# EAGLE design battery_pack (EAGLE 6.6.0)
AUTHOR: Joshua Adkins; REV: A; TITLE: Battery_Pack
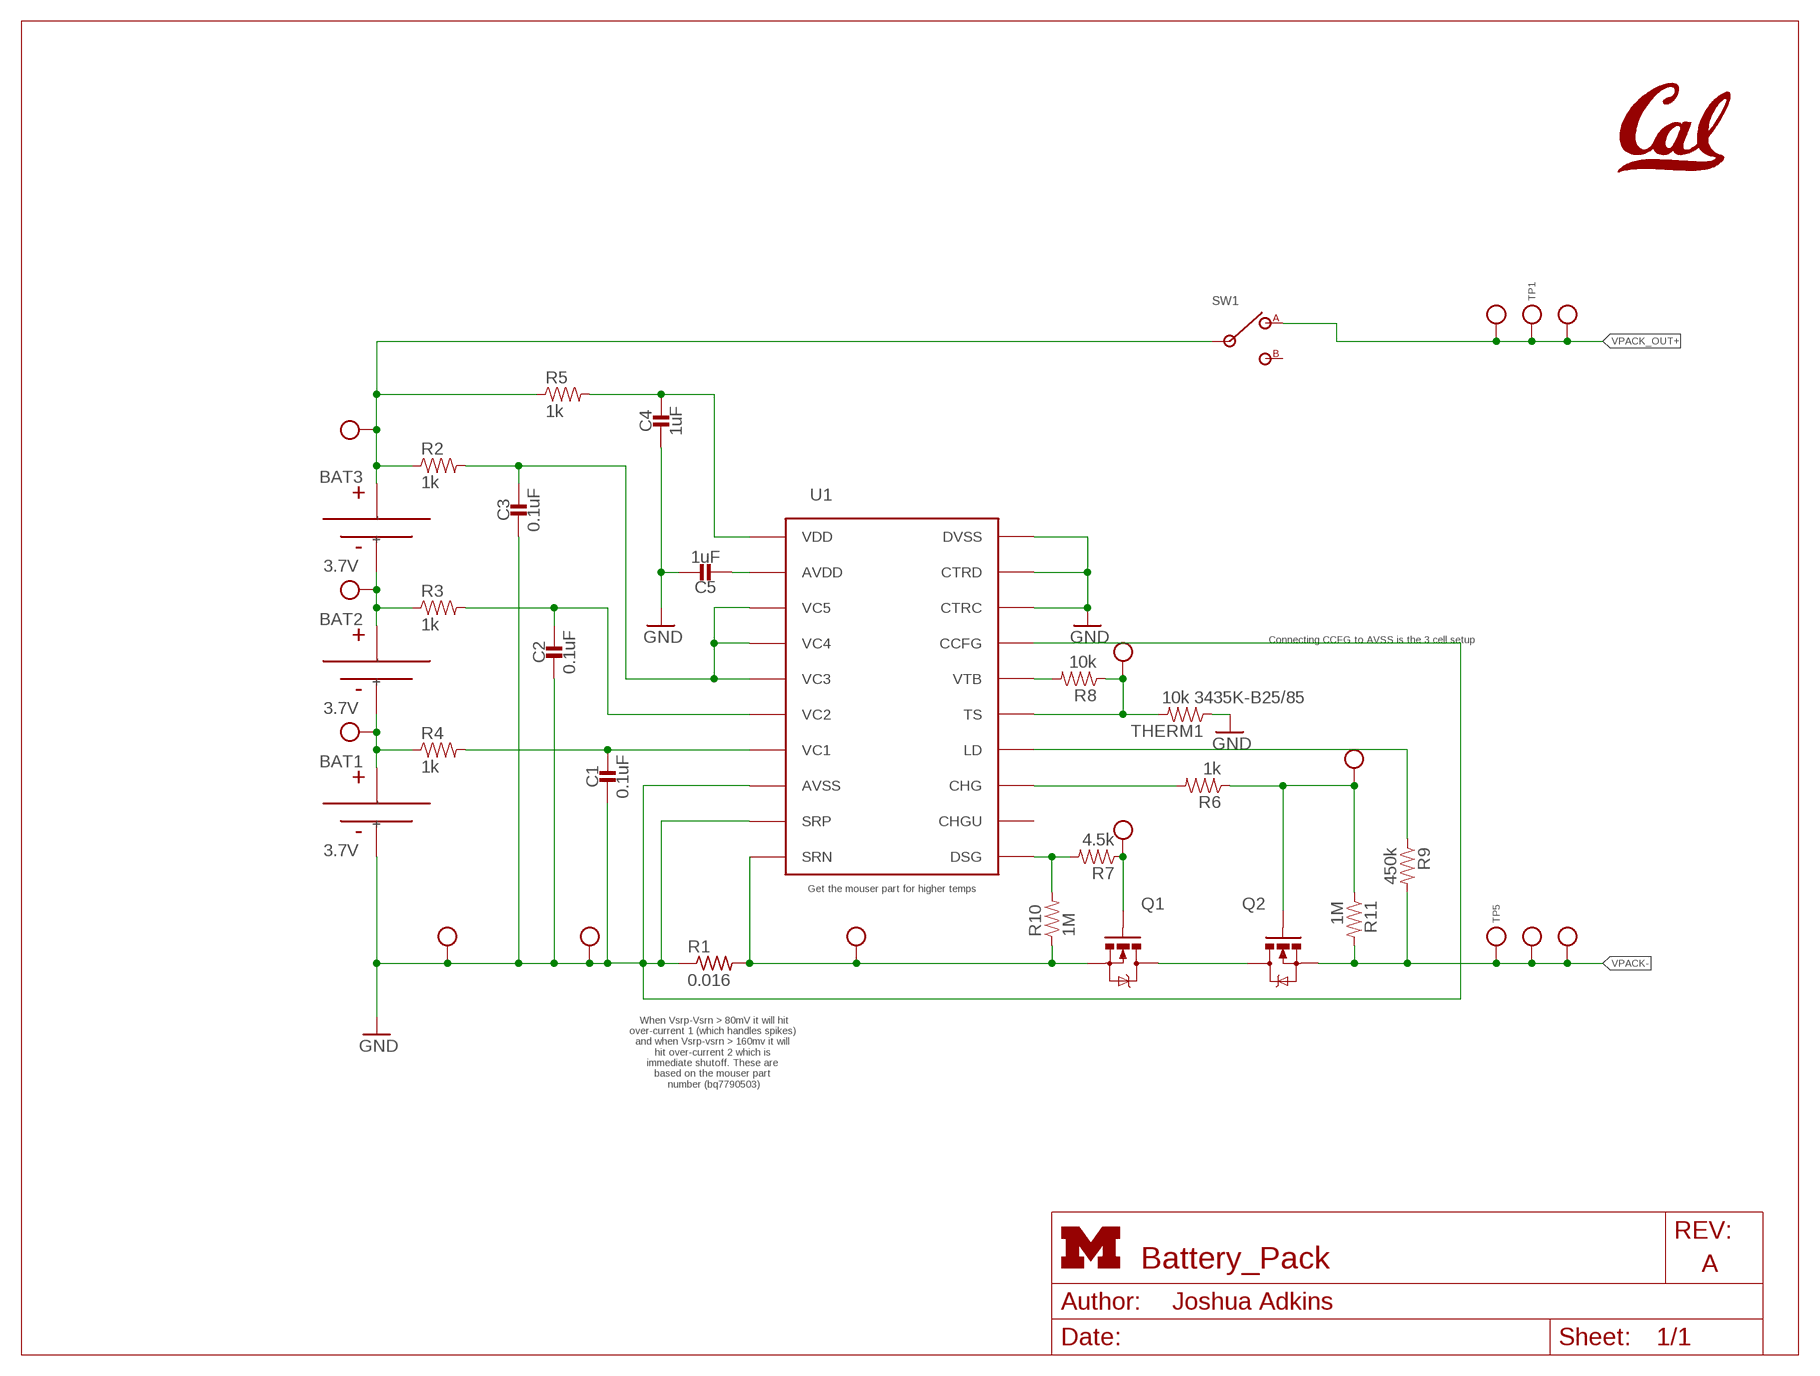
[diagram p0: schematic, sheet 1]
FRAME1 (LETTER_L_UMICH): HEIGHT: 8.5in; WIDTH: 11in

## Parts
BAT1  3.7V  BAT-CELL  [PL-809797-1C]
BAT2  3.7V  BAT-CELL  [PL-809797-1C]
BAT3  3.7V  BAT-CELL  [PL-809797-1C]
C1  0.1uF  CAPACITOR0603_CAP  [0603_CAP]
C2  0.1uF  CAPACITOR0603_CAP  [0603_CAP]
C3  0.1uF  CAPACITOR0603_CAP  [0603_CAP]
C4  1uF  CAPACITOR0603_CAP  [0603_CAP]
C5  1uF  CAPACITOR0603_CAP  [0603_CAP]
Q1  MOSFET-NCHANNELFDD8580  [DPAK]
Q2  MOSFET-NCHANNELFDD8580  [DPAK]
R1  0.016  R-US_R1206  [R1206]
R2  1k  RESISTOR0603_RES  [0603-RES]
R3  1k  RESISTOR0603_RES  [0603-RES]
R4  1k  RESISTOR0603_RES  [0603-RES]
R5  1k  RESISTOR0603_RES  [0603-RES]
R6  1k  RESISTOR0603_RES  [0603-RES]
R7  4.5k  RESISTOR0603_RES  [0603-RES]
R8  10k  RESISTOR0603_RES  [0603-RES]
R9  450k  RESISTOR0603_RES  [0603-RES]
R10  1M  RESISTOR0603_RES  [0603-RES]
R11  1M  RESISTOR0603_RES  [0603-RES]
SW1  500ASSP  [500ASSP]
THERM1  10k 3435K-B25/85  RESISTOR0603_RES  [0603-RES]
TP1  TEST_POINT_0.060IN  [TESTPOINT_0.060IN]
TP2  TEST_POINT_0.112IN  [TESTPOINT_0.112IN]
TP3  TEST_POINT_0.040IN  [TESTPOINT_0.040IN]
TP4  TEST_POINT_0.040IN  [TESTPOINT_0.040IN]
TP5  TEST_POINT_0.060IN  [TESTPOINT_0.060IN]
TP6  TEST_POINT_0.112IN  [TESTPOINT_0.112IN]
TP7  TEST_POINT_0.112IN  [TESTPOINT_0.112IN]
TP8  TEST_POINT_0.112IN  [TESTPOINT_0.112IN]
TP9  TEST_POINT_0.040IN  [TESTPOINT_0.040IN]
TP10  TEST_POINT_0.040IN  [TESTPOINT_0.040IN]
TP11  TEST_POINT_0.040IN  [TESTPOINT_0.040IN]
TP12  TEST_POINT_0.040IN  [TESTPOINT_0.040IN]
TP13  TEST_POINT_0.040IN  [TESTPOINT_0.040IN]
TP14  TEST_POINT_0.112IN  [TESTPOINT_0.112IN]
TP15  TEST_POINT_0.112IN  [TESTPOINT_0.112IN]
U1  BQ77904  [TSSOP-20/6MM]
U$1  UCB_CAL500MIL  [UCB_CAL_500MIL]

## Nets
GND: BAT1.- C1.2 C2.2 C3.2 C4.2 C5.1 R1.1 THERM1.1 TP7.1(TESTPOINT) TP9.TESTPOINT U1.8(AVSS) U1.9(SRP) U1.17(CCFG) U1.18(CTRC) U1.19(CTRD) U1.20(DVSS)
N$1: BAT1.+ BAT2.- R4.1 TP15.1(TESTPOINT)
N$2: BAT2.+ BAT3.- R3.1 TP14.1(TESTPOINT)
N$4: C1.1 R4.2 U1.7(VC1)
N$5: C2.1 R3.2 U1.6(VC2)
N$6: C3.1 R2.2 U1.3(VC5) U1.4(VC4) U1.5(VC3)
N$7: Q1.4(D) Q2.4(D)
N$8: Q1.3(S) R1.2 R10.1 TP10.TESTPOINT U1.10(SRN)
N$9: C4.1 R5.2 U1.1(VDD)
N$10: R7.2 R10.2 U1.11(DSG)
N$11: C5.2 U1.2(AVDD)
N$12: Q1.1(G) R7.1 TP11.TESTPOINT
N$13: R6.2 U1.13(CHG)
N$14: Q2.1(G) R6.1 R11.1 TP12.TESTPOINT
N$17: R9.1 U1.14(LD)
N$18: R8.2 U1.16(VTB)
N$19: R8.1 THERM1.2 TP13.TESTPOINT U1.15(TS)
VPACK+: BAT3.+ R2.1 R5.1 SW1.2 TP8.1(TESTPOINT)
VPACK-: Q2.3(S) R9.2 R11.2 TP2.1(TESTPOINT) TP4.TESTPOINT TP5.TESTPOINT
VPACK_OUT+: SW1.1 TP1.TESTPOINT TP3.TESTPOINT TP6.1(TESTPOINT)
Unconnected: SW1.3 U1.12(CHGU)

## Notes on the sheet
- Connecting CCFG to AVSS is the 3 cell setup
- Get the mouser part for higher temps
- When Vsrp-Vsrn > 80mV it will hit
  over-current 1 (which handles spikes) 
  and when Vsrp-vsrn > 160mv it will 
  hit over-current 2 which is 
  immediate shutoff. These are 
  based on the mouser part 
  number (bq7790503)

## Library data of the parts
BAT1-BAT3 = batteries:BAT-CELL: A single cell of a battery
C1-C3 = passives:CAPACITOR: SMD Capacitor; DESCRIPTION: CAP CER 0.1UF 25V Y5V 0603; DIGIKEY: 311-1087-1-ND; MANUFACTURER: Yageo; MPN: CC0603ZRY5V8BB104
C4 C5 = passives:CAPACITOR: SMD Capacitor; DESCRIPTION: CAP CER 1UF 25V X5R 0603; DIGIKEY: 311-1445-1-ND; MANUFACTURER: Yageo; MPN: CC0603KRX5R8BB105
Q1 Q2 = fets:MOSFET-NCHANNEL: Generic NMOS footprint; DESCRIPTION: MOSFET N-CH 40V 50A DPAK; DIGIKEY: FDD8447L_F085CT-ND; MANUFACTURER: Fairchild Semiconductor; MPN: FDD8447L_F085
R1 = resistor:R-US_: RESISTOR, American symbol; DESCRIPTION: RES SMD 16 MOHM 1% 1W 1206; DIGIKEY: P0.016BVCT-ND; MANUFACTURER: Panasonic; MPN: ERJ8CWFR016V
R2-R6 = passives:RESISTOR: Resistor Basic schematic elements and footprints for 0603, 1206, and PTH resistors.; DESCRIPTION: RES SMD 1K OHM 5% 1/10W 0603; DIGIKEY: 311-1.0KGRCT-ND; MANUFACTURER: Yageo; MPN: RC0603JR-071KL
R7 = passives:RESISTOR: Resistor Basic schematic elements and footprints for 0603, 1206, and PTH resistors.; DESCRIPTION: RES SMD 4.53K OHM 1% 1/10W 0603; DIGIKEY: 311-4.53KHRCT-ND; MANUFACTURER: Yageo; MPN: RC0603FR-074K53L
R8 = passives:RESISTOR: Resistor Basic schematic elements and footprints for 0603, 1206, and PTH resistors.; DESCRIPTION: RES SMD 10K OHM 5% 1/10W 0603; DIGIKEY: 311-10KGRCT-ND; MANUFACTURER: Yageo; MPN: RC0603JR-0710KL
R9 = passives:RESISTOR: Resistor Basic schematic elements and footprints for 0603, 1206, and PTH resistors.; DESCRIPTION: RES SMD 453K OHM 1% 1/10W 0603; DIGIKEY: 311-453KHRCT-ND; MANUFACTURER: Yageo; MPN: RC0603FR-07453KL
R10 R11 = passives:RESISTOR: Resistor Basic schematic elements and footprints for 0603, 1206, and PTH resistors.; DESCRIPTION: RES SMD 1M OHM 5% 1/10W 0603; DIGIKEY: 311-1.0MGRCT-ND; MANUFACTURER: Yageo; MPN: RC0603JR-071ML
SW1 = switches:500ASSP: High current slide switch; DIGIKEY: EG2483-ND; MANUFACTURER: EWSITCH; MPN: 500ASSP1M6QE
THERM1 = passives:RESISTOR: Resistor Basic schematic elements and footprints for 0603, 1206, and PTH resistors.; DESCRIPTION: NTC THERMISTOR 10K OHM 1% 0603; DIGIKEY: 445-2554-1-ND; MANUFACTURER: TDK; MPN: NTCG163JF103FT1
TP1 TP5 = headers:TEST_POINT_0.060IN: A 60mil Testpoint
TP2 TP6-TP8 TP14 TP15 = headers:TEST_POINT_0.112IN: Solder terminal, turreted; NEWARK: 40F6015
TP3 TP4 TP9-TP13 = headers:TEST_POINT_0.040IN: 0.040in Test Point; DIGIKEY: 5001K-ND
U1 = chips:BQ77904: A battery protection chip with OV/UV/OT/UT; DIGIKEY: 296-44599-5-ND; MANUFACTURER: TI; MOUSER: 595-BQ7790503PW; MPN: BQ7790503PW
U$1 = logos:UCB_CAL

## Board
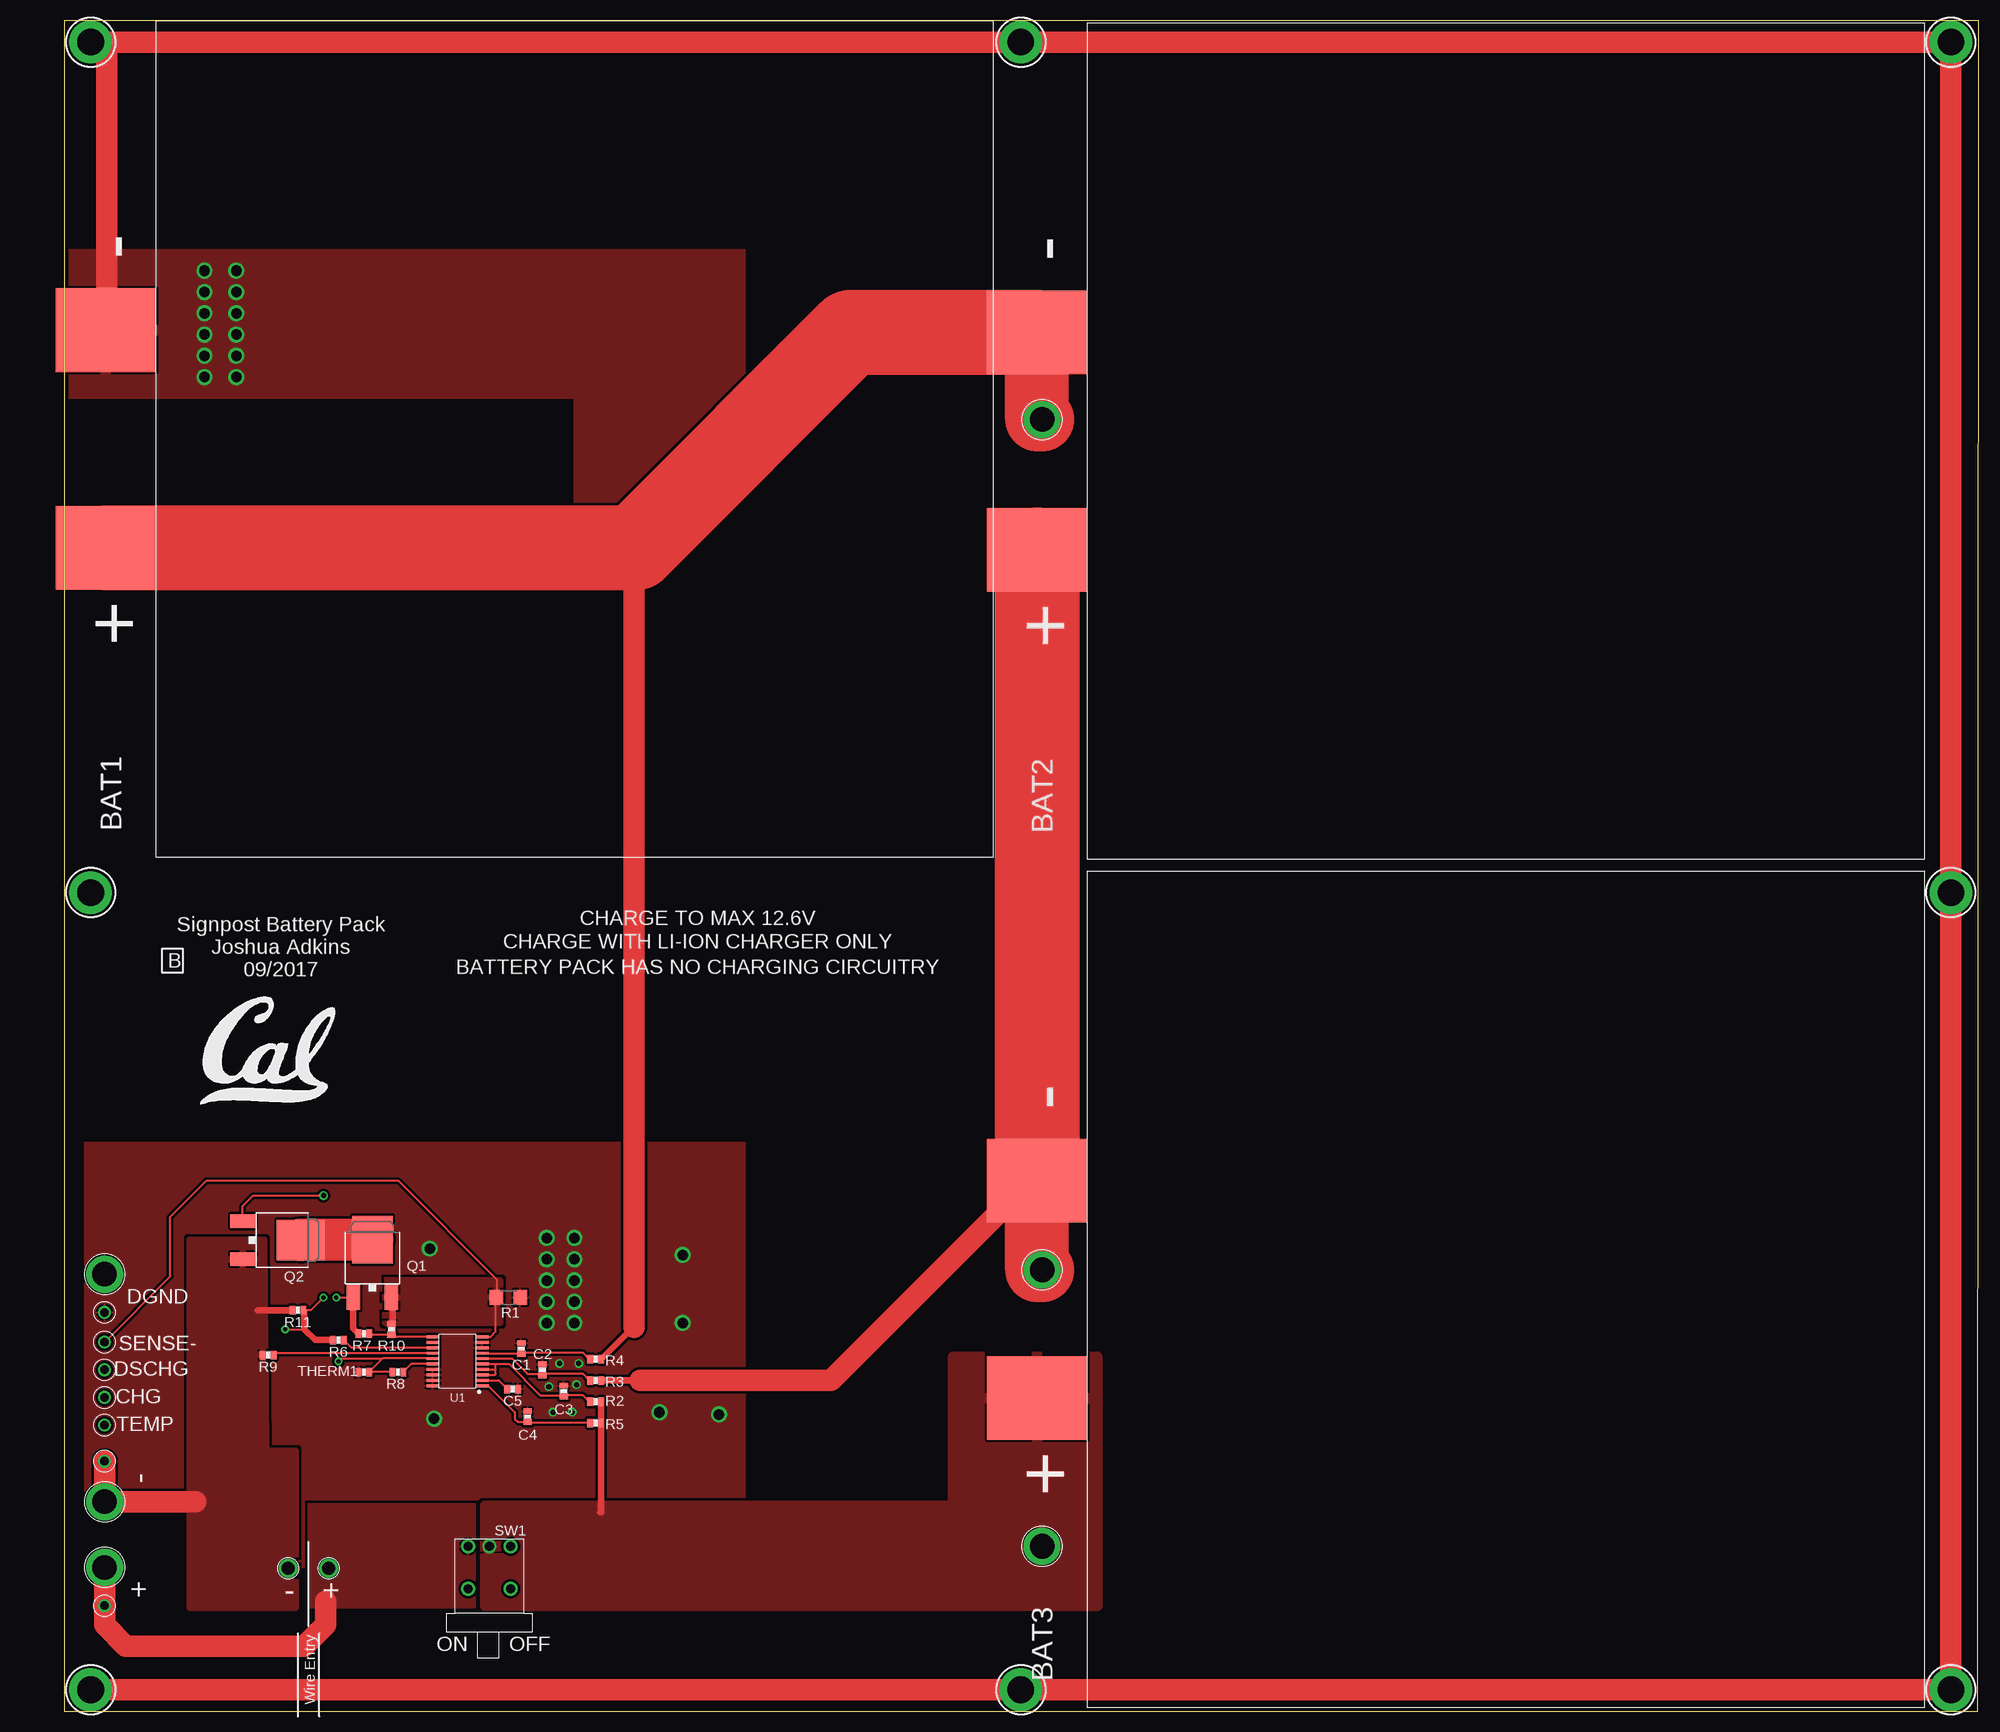
[diagram p1: board, top side]
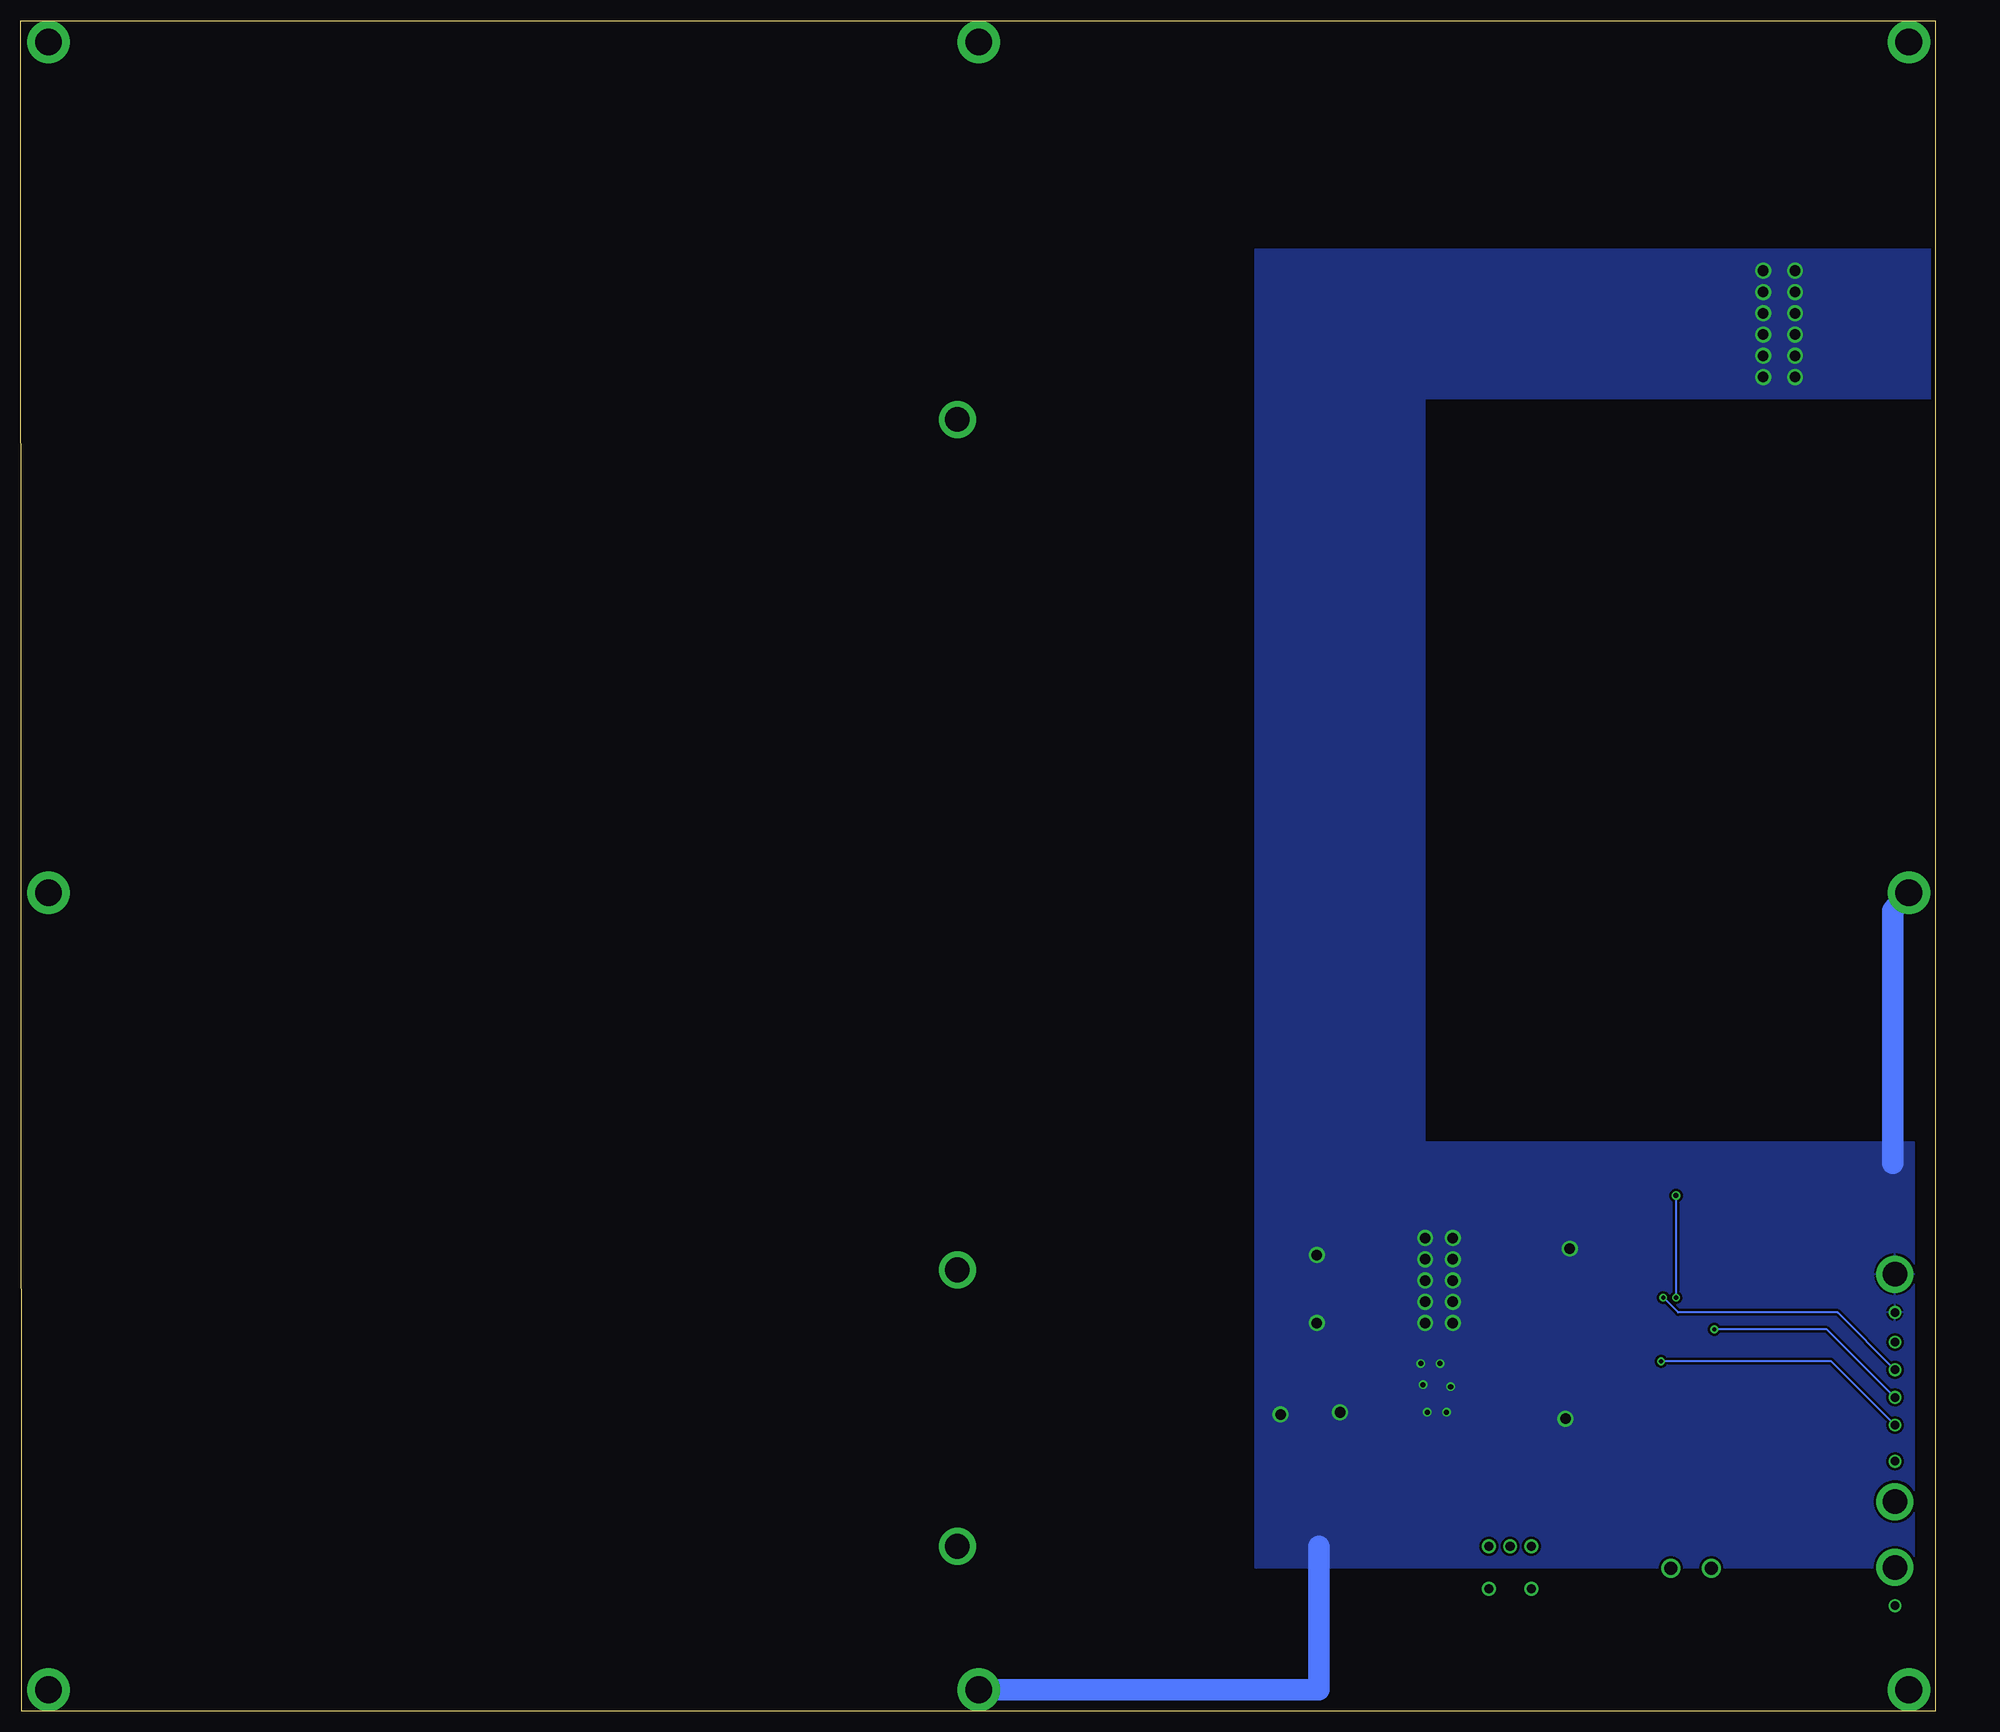
[diagram p2: board, bottom side, seen from below]

Size 228.73 x 201.93 mm. Coordinates in mm from the lower left corner, seen from the top.
Outline: 0,0 228.6,0 228.73,201.93 0.02,201.93 0,0
Copper layers (1*16): Top 0.0178mm / dielectric 59mil / Bottom 0.0178mm
Design rules "quickturn_co_kr_1oz": minimum track width 4mil, minimum drill 0.200659375mm, track to track 4mil, track to pad 4mil, pad to pad 4mil, via to via 4mil, smd to smd 4mil, copper to edge 20mil, drill to drill 16mil, minimum pad ring 8mil, minimum via ring 8mil, stop-mask expansion 3mil, vias tented up to drill 50mil, thermal gap 10mil

### Footprints (pad centres in the part's own frame; a part is rotated, then mirrored left to right if it is on the bottom)
PL-809797-1C = smd 10 x 12: + 37,106; - 63,106
0603_CAP = smd 0.7 x 1: 1 -0.65,0; 2 0.65,0
DPAK = smd 1.6 x 3: 1 -2.28,-5.31; 3 2.28,-5.31 | smd 4.826 x 5.715: 4 0,1.588
R1206 = smd 1.6 x 1.803: 1 -1.422,0; 2 1.422,0
0603-RES = smd 0.7 x 1: 1 -0.65,0; 2 0.65,0
500ASSP = drill 1.09: 1 2.54,0; 2 0,0; 3 -2.54,0; P$4 2.54,5.08; P$5 -2.54,5.08
TESTPOINT_0.060IN = drill 1.524: TESTPOINT -0.02,0.033
TESTPOINT_0.112IN = drill 2.946: 1 0,0
TESTPOINT_0.040IN = drill 1.016: TESTPOINT 0,0
TSSOP-20/6MM = smd 1.5 x 0.35: 1 -2.95,2.925; 2 -2.95,2.275; 3 -2.95,1.625; 4 -2.95,0.975; 5 -2.95,0.325; 6 -2.95,-0.325; 7 -2.95,-0.975; 8 -2.95,-1.625; 9 -2.95,-2.275; 10 -2.95,-2.925; 11 2.95,-2.925; 12 2.95,-2.275; 13 2.95,-1.625; 14 2.95,-0.975; 15 2.95,-0.325; 16 2.95,0.325; 17 2.95,0.975; 18 2.95,1.625; 19 2.95,2.275; 20 2.95,2.925

### Placement (x,y rotation side)
BAT1  111,101.98 90 top
BAT2  222.25,101.73 90 top
BAT3  222.25,0.38 90 top
C1  54.61,43.31 90 top
C2  57.15,40.77 90 top
C3  59.69,38.23 90 top
C4  55.37,35.18 90 top
C5  53.59,38.48 180 top
Q1  36.83,54.74 0 top
Q2  26.67,56.26 270 top
R1  53.09,49.4 180 top
R2  63.5,36.96 180 top
R3  63.5,39.5 180 top
R4  63.5,42.04 180 top
R5  63.5,34.42 180 top
R6  32.77,44.32 0 top
R7  35.81,45.09 0 top
R8  39.88,40.51 0 top
R9  24.38,42.55 180 top
R10  39.12,45.59 270 top
R11  27.94,47.88 180 top
SW1  50.8,19.68 180 top
THERM1  35.81,40.51 0 top
TP1  31.62,17.02 0 top
TP2  4.83,25.02 180 top
TP3  4.83,12.57 180 top
TP4  4.83,29.84 180 top
TP5  26.8,17.02 0 top
TP6  4.83,17.14 180 top
TP7  4.83,52.2 180 top
TP8  116.84,19.68 180 top
TP9  4.83,47.62 180 top
TP10  4.83,44.07 270 top
TP11  4.83,40.77 270 top
TP12  4.83,37.47 270 top
TP13  4.83,34.16 270 top
TP14  116.84,52.7 180 top
TP15  116.84,154.31 180 top
U1  46.99,41.78 180 top
U$1  16.26,72.52 0 top

### Tracks (layer width: path | path; a pad name or v marks a point on that pad's centre or on a via)
GND  (via drill 0.61, 1.27, 3.17 pad 5.08)
  Top 2.54: v3.17,2.54 v114.3,2.54 v225.43,2.54 v225.43,97.79 v225.43,199.39 v114.3,199.39 v3.17,199.39 5.08,199.39 5.08,164.47
  Bottom 2.54: v114.3,2.54 73.66,2.54 73.66,19.68 | v3.17,97.79 5.08,95.63 5.08,65.41
  other vias: 16.76,159.38 16.76,161.93 16.76,164.47 16.76,167 16.76,169.54 16.76,172.09 20.57,159.38 20.57,161.93 20.57,164.47 20.57,167 20.57,169.54 20.57,172.09 43.69,55.24 44.2,34.92 57.66,46.35 57.66,48.9 57.66,51.44 57.66,53.98 57.66,56.52 57.91,38.73 58.42,35.69 59.18,41.53 60.71,35.69 60.96,46.35 60.96,48.9 60.96,51.44 60.96,53.98 60.96,56.52 61.21,38.99 61.47,41.53 71.12,35.69 73.91,46.35 73.91,54.48 78.23,35.43
  pour Bottom (isolate 0.305): 81.28,17.14 2.54,17.14 2.54,67.94 81.28,67.94
  pour Bottom (isolate 0.305): 0,174.62 81.28,174.62 81.28,57.78 60.96,57.78 60.96,156.84 0,156.84
  pour Top (isolate 0.305, rank 2): 81.28,17.14 2.54,17.14 2.54,67.94 81.28,67.94
  pour Top (isolate 0.305): 0,174.62 81.28,174.62 81.28,57.78 60.96,57.78 60.96,156.84 0,156.84
  pour Top (isolate 0.305): 12.19,158.62 12.19,172.59 0.25,172.59 0.25,158.62
N$1
  Top 0.254: 68.07,45.85 67.96,45.85
  Top 0.762: 67.96,45.85 R4.1
  Top 10.16: BAT2.- 116.24,164.72 93.98,164.72 68.71,139.45 68.24,138.98 BAT1.+
  Top 2.54: 68.07,45.85 68.07,138.81 68.71,139.45
  Top 7.62: BAT2.- 116.25,154.31 TP15.1
N$2
  Top 0.762: R3.1 68.83,39.5
  Top 10.16: BAT2.+ 116.25,65.41 116.25,64.14 BAT3.-
  Top 2.54: 68.83,39.5 91.61,39.5 116.25,64.14
  Top 7.62: 116.25,65.41 116.25,52.7 TP14.1
N$4
  Top 0.254: U1.7 54.51,42.76 C1.1 54.75,42.8 61.98,42.8 62.74,42.04 R4.2
N$5
  Top 0.254: U1.6 53.52,42.11 55.37,40.26 57.01,40.26 C2.1 57.29,40.26 61.98,40.26 62.74,39.5 R3.2
N$6
  Top 0.254: U1.3 51.46,40.16 51.56,40.26 51.56,40.77 | U1.4 51.52,40.81 51.56,40.77 | U1.5 51.56,41.46 | 51.56,40.77 51.56,41.46 | 51.56,41.46 53.16,41.46 56.9,37.72 59.55,37.72 C3.1 59.83,37.72 61.98,37.72 62.74,36.96 R2.2
N$7
  Top 5.08: Q1.4 Q2.4
N$8
  Top 0.254: TP10.TESTPOINT 12.7,51.94 12.7,59.05 17.02,63.37 39.88,63.37 51.66,51.59 R1.2 51.56,49.3 51.56,45.34 50.93,44.71 U1.10
  Top 0.762: R10.1 39.24,46.36 39.24,49.3
  Top 1.27: 39.24,49.3 Q1.3
  pour Top (isolate 0.305): 52.07,51.44 38.35,51.44 38.35,46.35 52.07,46.35
N$9
  Top 0.254: U1.1 50.68,38.86 53.85,35.69 53.85,34.92 54.24,34.53 C4.1 55.48,34.42 R5.2
N$10
  Top 0.254: R7.2 36.61,44.94 R10.2 39.35,44.71 U1.11
N$11
  Top 0.254: U1.2 51.92,39.51 C5.2
N$12  (via drill 0.51)
  Top 0.254: v32.51,49.4 34.53,49.4 Q1.1
  Top 0.762: R7.1 34.55,45.7 Q1.1
  Bottom 0.254: v32.51,49.4 30.73,47.62 11.68,47.62 TP11.TESTPOINT
N$13
  Top 0.254: R6.2 34.33,43.41 U1.13
N$14  (via drill 0.51, 0.61)
  Top 0.254: Q2.1 21.36,60.35 22.61,61.59 v30.99,61.59 | v26.42,45.59 28.7,45.59 | 28.7,47.77 R11.1 29.46,47.88 v30.99,49.4
  Top 0.762: 28.7,47.77 28.7,45.59 29.97,44.32 R6.1
  Bottom 0.254: v26.42,45.59 12.95,45.59 TP12.TESTPOINT | v30.99,61.59 v30.99,49.4
N$17
  Top 0.254: R9.1 25.25,42.76 U1.14
N$18
  Top 0.254: R8.2 41.47,41.46 U1.16
N$19  (via drill 0.51)
  Top 0.254: v32.77,41.78 33.09,42.11 38.06,42.11 | 38.06,42.11 THERM1.2 R8.1 | U1.15 38.06,42.11
  Bottom 0.254: v32.77,41.78 12.45,41.78 TP13.TESTPOINT
VPACK+
  Top 0.762: 64.01,23.75 64.15,23.75 R5.1 R2.1
  pour Top (isolate 0.305): 123.44,42.29 123.44,12.57 50.29,12.57 50.29,24.51 106.17,24.51 106.17,42.29
VPACK-
  Top 0.762: R11.2 23.11,47.88
  Top 2.54: 15.75,25.02 TP2.1 TP4.TESTPOINT
  pour Top (isolate 0.305): 23.88,56.26 24.13,31.11 27.69,31.11 27.69,12.32 14.99,12.32 14.99,56.26
VPACK_OUT+
  Top 2.54: 31.24,13.08 31.24,10.29 28.7,7.75 7.37,7.75 4.83,10.29 TP3.TESTPOINT TP6.1
  pour Top (isolate 0.305): 49.02,24.77 49.02,12.32 29.21,12.32 29.21,24.77

### Text on the board
tPlace: CHARGE TO MAX 12.6V | Signpost Battery Pack / Joshua Adkins / 09/2017 | CHARGE WITH LI-ION CHARGER ONLY | B | BATTERY PACK HAS NO CHARGING CIRCUITRY | DGND | SENSE- | DSCHG | CHG | TEMP | - | + | + | - | ON | OFF | Wire Entry